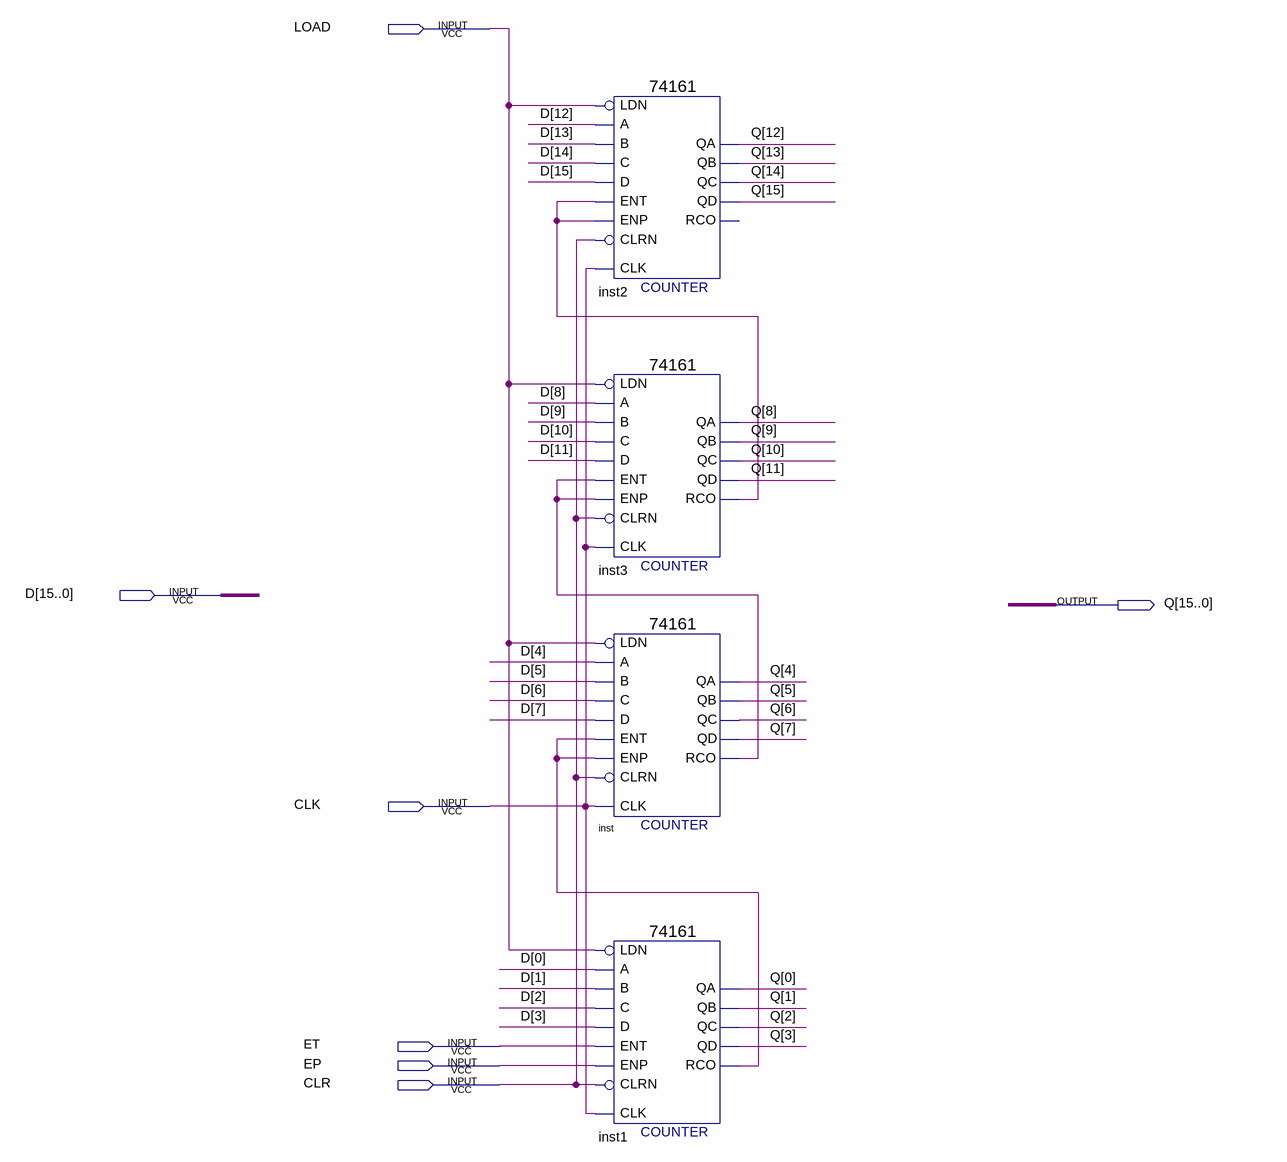
[diagram p0: schematic sheet]
// Quartus schematic PC.bdf as structural Verilog: 4 symbols, 7 pins
module PC (
  input  LOAD,
  input  [15:0] D,
  input  CLK,
  input  ET,
  input  EP,
  input  CLR,
  output [15:0] Q
);

  wire inst1_rco, inst3_rco, inst_rco;

  \74161  inst2 (
    .CLRN(CLR), .CLK(CLK), .ENP(inst3_rco), .LDN(LOAD), .A(D[12]), .D(D[15]), .ENT(inst3_rco), .B(D[13]),
    .C(D[14]), .QD(Q[15]), .QC(Q[14]), .QB(Q[13]), .QA(Q[12]));  // open: RCO
  \74161  inst3 (
    .CLRN(CLR), .CLK(CLK), .ENP(inst_rco), .LDN(LOAD), .A(D[8]), .D(D[11]), .ENT(inst_rco), .B(D[9]),
    .C(D[10]), .QD(Q[11]), .QC(Q[10]), .QB(Q[9]), .QA(Q[8]), .RCO(inst3_rco));
  \74161  inst (
    .CLRN(CLR), .CLK(CLK), .ENP(inst1_rco), .LDN(LOAD), .A(D[4]), .D(D[7]), .ENT(inst1_rco), .B(D[5]),
    .C(D[6]), .QD(Q[7]), .QC(Q[6]), .QB(Q[5]), .QA(Q[4]), .RCO(inst_rco));
  \74161  inst1 (
    .CLRN(CLR), .CLK(CLK), .ENP(EP), .LDN(LOAD), .A(D[0]), .D(D[3]), .ENT(ET), .B(D[1]), .C(D[2]), .QD(Q[3]),
    .QC(Q[2]), .QB(Q[1]), .QA(Q[0]), .RCO(inst1_rco));
endmodule
